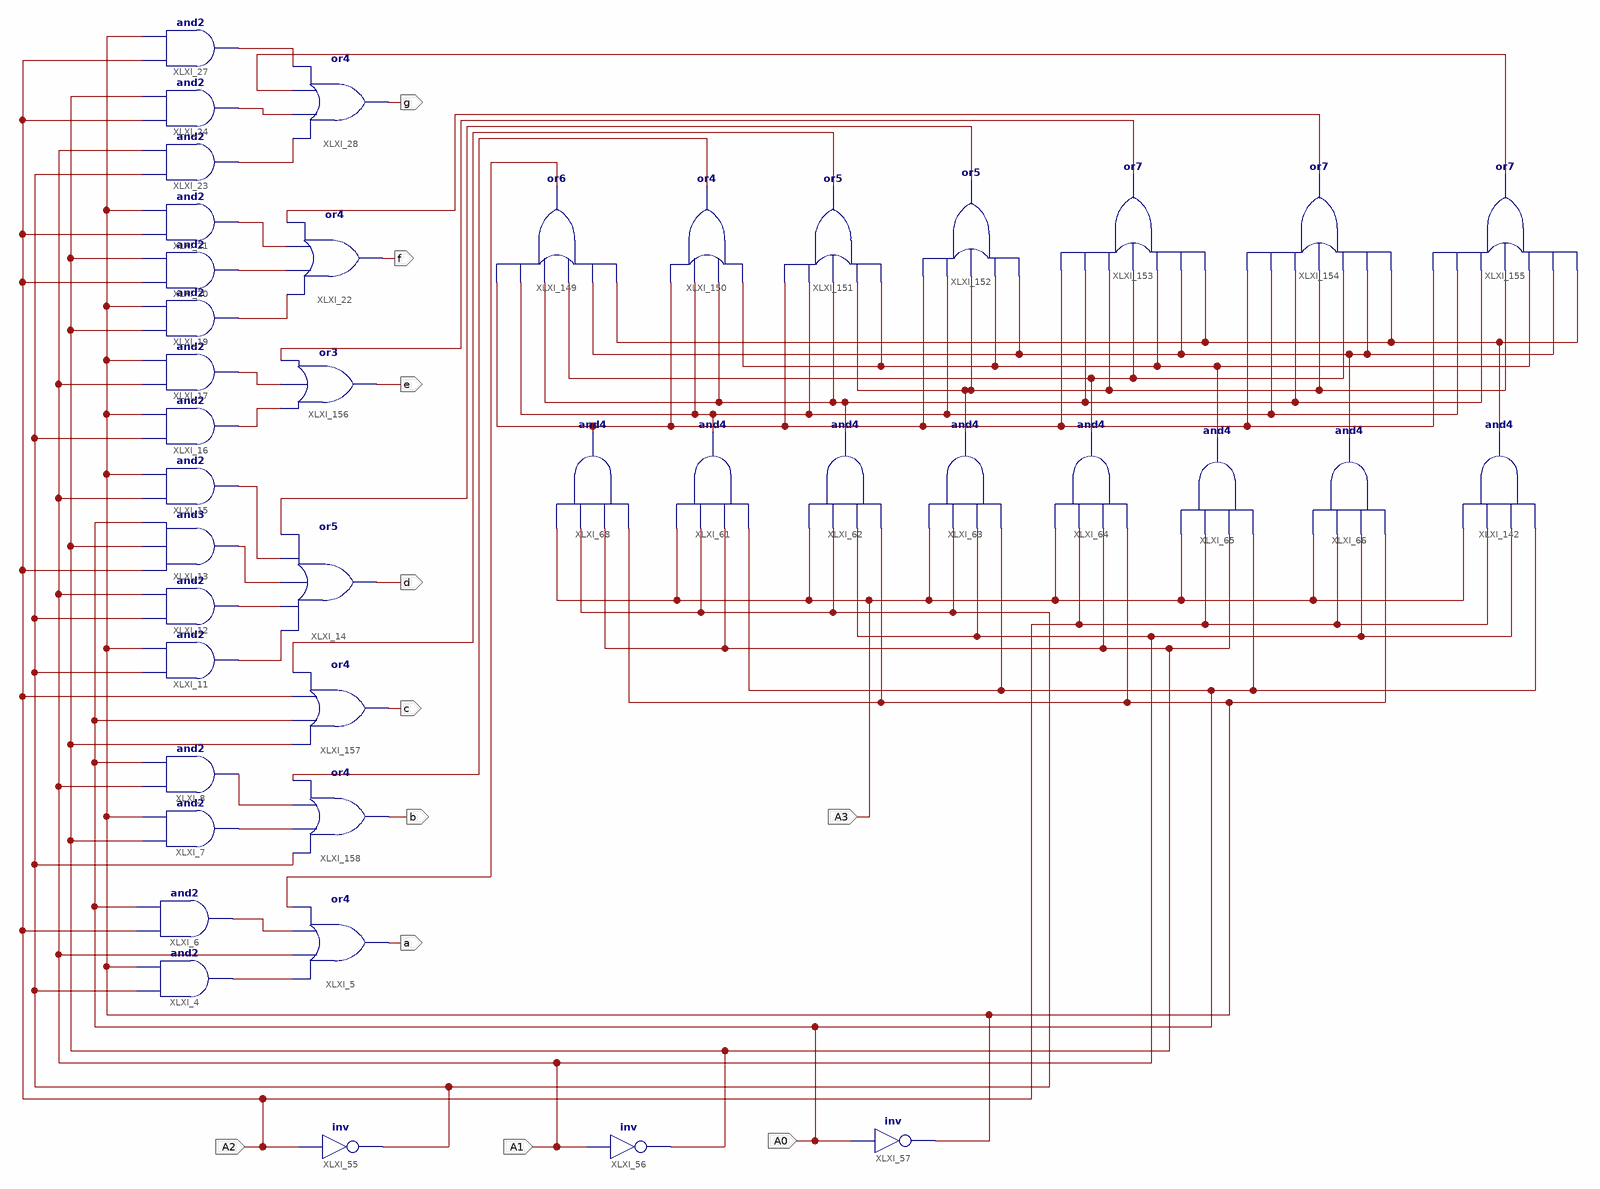
[diagram p0: schematic sheet 1]
// Xilinx ISE schematic BCDtoSegment_HEX.sch (spartan6) as structural Verilog: 41 symbols, 11 ports
module BCDtoSegment_HEX (
  input  A3,
  input  A1,
  input  A2,
  input  A0,
  output a,
  output d,
  output f,
  output g,
  output e,
  output b,
  output c
);

  wire XLXN_5, XLXN_9, XLXN_10, XLXN_13, XLXN_14, XLXN_18, XLXN_19, XLXN_20, XLXN_37, XLXN_40, XLXN_41,
       XLXN_44, XLXN_45, XLXN_46, XLXN_48, XLXN_49, XLXN_50, XLXN_102, XLXN_106, XLXN_204, XLXN_205,
       XLXN_206, XLXN_211, XLXN_212, XLXN_214, XLXN_216, XLXN_235, XLXN_269, XLXN_271, XLXN_274, XLXN_283,
       XLXN_352, XLXN_355, XLXN_359;

  and XLXI_4 (XLXN_9, XLXN_102, XLXN_106);
  or XLXI_5 (a, XLXN_9, A1, XLXN_10, XLXN_352);
  and XLXI_6 (XLXN_10, A2, A0);
  and XLXI_7 (XLXN_14, XLXN_5, XLXN_106);
  and XLXI_8 (XLXN_13, A1, A0);
  and XLXI_11 (XLXN_18, XLXN_102, XLXN_106);
  and XLXI_12 (XLXN_19, XLXN_102, A1);
  and XLXI_13 (XLXN_20, A2, XLXN_5, A0);
  or XLXI_14 (d, XLXN_18, XLXN_19, XLXN_20, XLXN_37, XLXN_359);
  and XLXI_15 (XLXN_37, A1, XLXN_106);
  and XLXI_16 (XLXN_41, XLXN_102, XLXN_106);
  and XLXI_17 (XLXN_40, A1, XLXN_106);
  and XLXI_19 (XLXN_44, XLXN_5, XLXN_106);
  and XLXI_20 (XLXN_45, A2, XLXN_5);
  and XLXI_21 (XLXN_46, A2, XLXN_106);
  or XLXI_22 (f, XLXN_44, XLXN_45, XLXN_46, XLXN_283);
  and XLXI_23 (XLXN_50, XLXN_102, A1);
  and XLXI_24 (XLXN_49, A2, XLXN_5);
  and XLXI_27 (XLXN_48, A2, XLXN_106);
  or XLXI_28 (g, XLXN_50, XLXN_49, XLXN_355, XLXN_48);
  not XLXI_55 (XLXN_102, A2);
  not XLXI_56 (XLXN_5, A1);
  not XLXI_57 (XLXN_106, A0);
  and XLXI_66 (XLXN_212, XLXN_106, A1, A2, A3);
  and XLXI_65 (XLXN_235, A0, XLXN_5, A2, A3);
  and XLXI_64 (XLXN_214, XLXN_106, XLXN_5, A2, A3);
  and XLXI_63 (XLXN_216, A0, A1, XLXN_102, A3);
  and XLXI_62 (XLXN_206, XLXN_106, A1, XLXN_102, A3);
  and XLXI_61 (XLXN_205, A0, XLXN_5, XLXN_102, A3);
  and XLXI_142 (XLXN_211, A0, A1, A2, A3);
  and XLXI_68 (XLXN_204, XLXN_106, XLXN_5, XLXN_102, A3);
  or XLXI_149 (XLXN_352, XLXN_211, XLXN_212, XLXN_214, XLXN_206, XLXN_205, XLXN_204);
  or XLXI_150 (XLXN_269, XLXN_235, XLXN_206, XLXN_205, XLXN_204);
  or XLXI_151 (XLXN_271, XLXN_235, XLXN_216, XLXN_206, XLXN_205, XLXN_204);
  or XLXI_152 (XLXN_359, XLXN_212, XLXN_235, XLXN_216, XLXN_205, XLXN_204);
  or XLXI_153 (XLXN_274, XLXN_211, XLXN_212, XLXN_235, XLXN_214, XLXN_216, XLXN_206, XLXN_204);
  or XLXI_154 (XLXN_283, XLXN_211, XLXN_212, XLXN_214, XLXN_216, XLXN_206, XLXN_205, XLXN_204);
  or XLXI_155 (XLXN_355, XLXN_211, XLXN_212, XLXN_235, XLXN_216, XLXN_206, XLXN_205, XLXN_204);
  or XLXI_156 (e, XLXN_41, XLXN_40, XLXN_274);
  or XLXI_157 (c, XLXN_5, A0, A2, XLXN_271);
  or XLXI_158 (b, XLXN_102, XLXN_14, XLXN_13, XLXN_269);
endmodule
